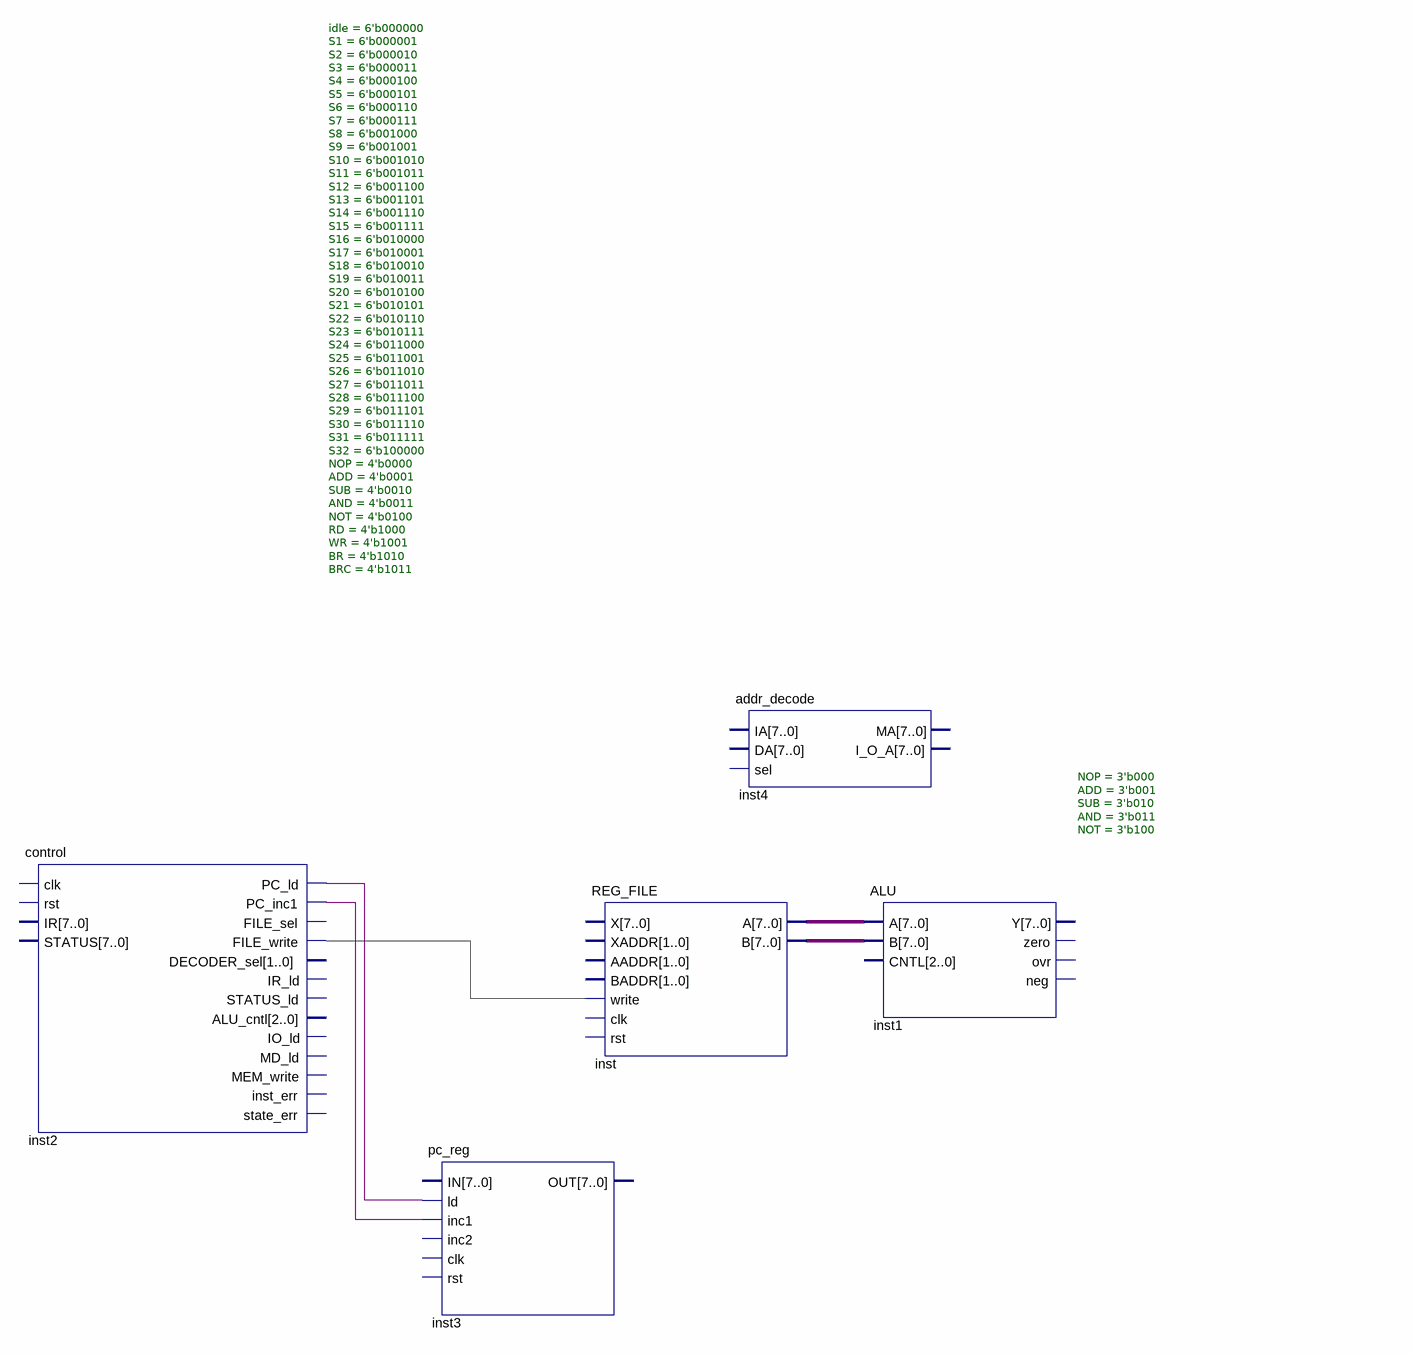
[diagram p0: schematic sheet]
// Quartus schematic controller.bdf as structural Verilog: 5 symbols, 0 pins
module controller (
);

  wire inst2_pc_inc1, inst2_pc_ld;
  wire [7:0] inst_a, inst_b;

  control #(.idle(6'b000000), .S1(6'b000001), .S2(6'b000010), .S3(6'b000011), .S4(6'b000100), .S5(6'b000101), .S6(6'b000110), .S7(6'b000111), .S8(6'b001000), .S9(6'b001001), .S10(6'b001010), .S11(6'b001011), .S12(6'b001100), .S13(6'b001101), .S14(6'b001110), .S15(6'b001111), .S16(6'b010000), .S17(6'b010001), .S18(6'b010010), .S19(6'b010011), .S20(6'b010100), .S21(6'b010101), .S22(6'b010110), .S23(6'b010111), .S24(6'b011000), .S25(6'b011001), .S26(6'b011010), .S27(6'b011011), .S28(6'b011100), .S29(6'b011101), .S30(6'b011110), .S31(6'b011111), .S32(6'b100000), .NOP(4'b0000), .ADD(4'b0001), .SUB(4'b0010), .AND(4'b0011), .NOT(4'b0100), .RD(4'b1000), .WR(4'b1001), .BR(4'b1010), .BRC(4'b1011)) inst2 (
    .PC_ld(inst2_pc_ld), .PC_inc1(inst2_pc_inc1));  // open: clk, rst, IR, STATUS, FILE_sel, FILE_write, DECODER_sel, IR_ld, STATUS_ld, ALU_cntl, IO_ld, MD_ld, MEM_write, inst_err, state_err
  pc_reg inst3 (.ld(inst2_pc_ld), .inc1(inst2_pc_inc1));  // open: IN, inc2, clk, rst, OUT
  REG_FILE inst (.A(inst_a), .B(inst_b));  // open: X, XADDR, AADDR, BADDR, write, clk, rst
  addr_decode inst4 ();  // open: IA, DA, sel, MA, I_O_A
  ALU #(.NOP(3'b000), .ADD(3'b001), .SUB(3'b010), .AND(3'b011), .NOT(3'b100)) inst1 (
    .A(inst_a), .B(inst_b));  // open: CNTL, Y, zero, ovr, neg
endmodule
